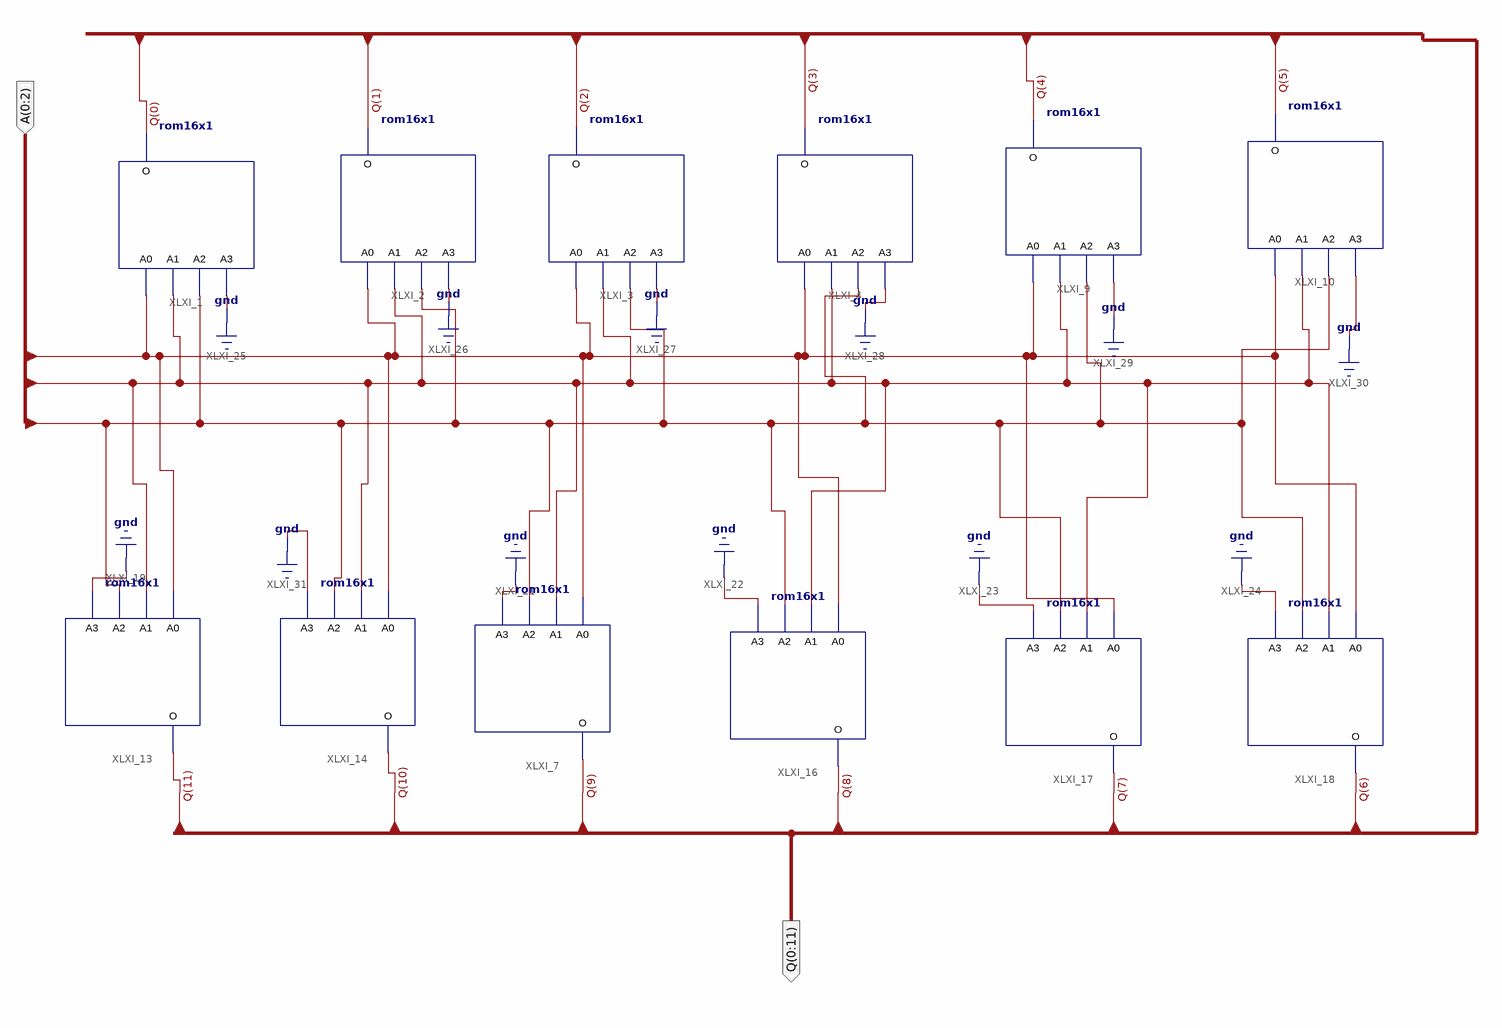
[diagram p0: schematic sheet 1]
// Xilinx ISE schematic RomSet.sch (spartan3e) as structural Verilog: 12 symbols, 2 ports
module RomSet (
  input  [0:2] A,
  output [0:11] Q
);

  rom16x1 #(.INIT("000B")) XLXI_1 (.A0(A[2]), .A1(A[1]), .A2(A[0]), .A3(1'b0), .O(Q[0]));
  rom16x1 #(.INIT("0000")) XLXI_2 (.A0(A[2]), .A1(A[1]), .A2(A[0]), .A3(1'b0), .O(Q[1]));
  rom16x1 #(.INIT("0015")) XLXI_3 (.A0(A[2]), .A1(A[1]), .A2(A[0]), .A3(1'b0), .O(Q[2]));
  rom16x1 #(.INIT("0015")) XLXI_4 (.A0(A[2]), .A1(A[1]), .A2(A[0]), .A3(1'b0), .O(Q[3]));
  rom16x1 #(.INIT("001F")) XLXI_9 (.A0(A[2]), .A1(A[1]), .A2(A[0]), .A3(1'b0), .O(Q[4]));
  rom16x1 #(.INIT("0000")) XLXI_10 (.A0(A[2]), .A1(A[1]), .A2(A[0]), .A3(1'b0), .O(Q[5]));
  rom16x1 #(.INIT("0009")) XLXI_13 (.A0(A[2]), .A1(A[1]), .A2(A[0]), .A3(1'b0), .O(Q[11]));
  rom16x1 #(.INIT("0003")) XLXI_14 (.A0(A[2]), .A1(A[1]), .A2(A[0]), .A3(1'b0), .O(Q[10]));
  rom16x1 #(.INIT("0000")) XLXI_7 (.A0(A[2]), .A1(A[1]), .A2(A[0]), .A3(1'b0), .O(Q[9]));
  rom16x1 #(.INIT("0000")) XLXI_16 (.A0(A[2]), .A1(A[1]), .A2(A[0]), .A3(1'b0), .O(Q[8]));
  rom16x1 #(.INIT("0014")) XLXI_17 (.A0(A[2]), .A1(A[1]), .A2(A[0]), .A3(1'b0), .O(Q[7]));
  rom16x1 #(.INIT("0000")) XLXI_18 (.A0(A[2]), .A1(A[1]), .A2(A[0]), .A3(1'b0), .O(Q[6]));
endmodule
